# EAGLE design overall_connections (EAGLE 7.5.0)
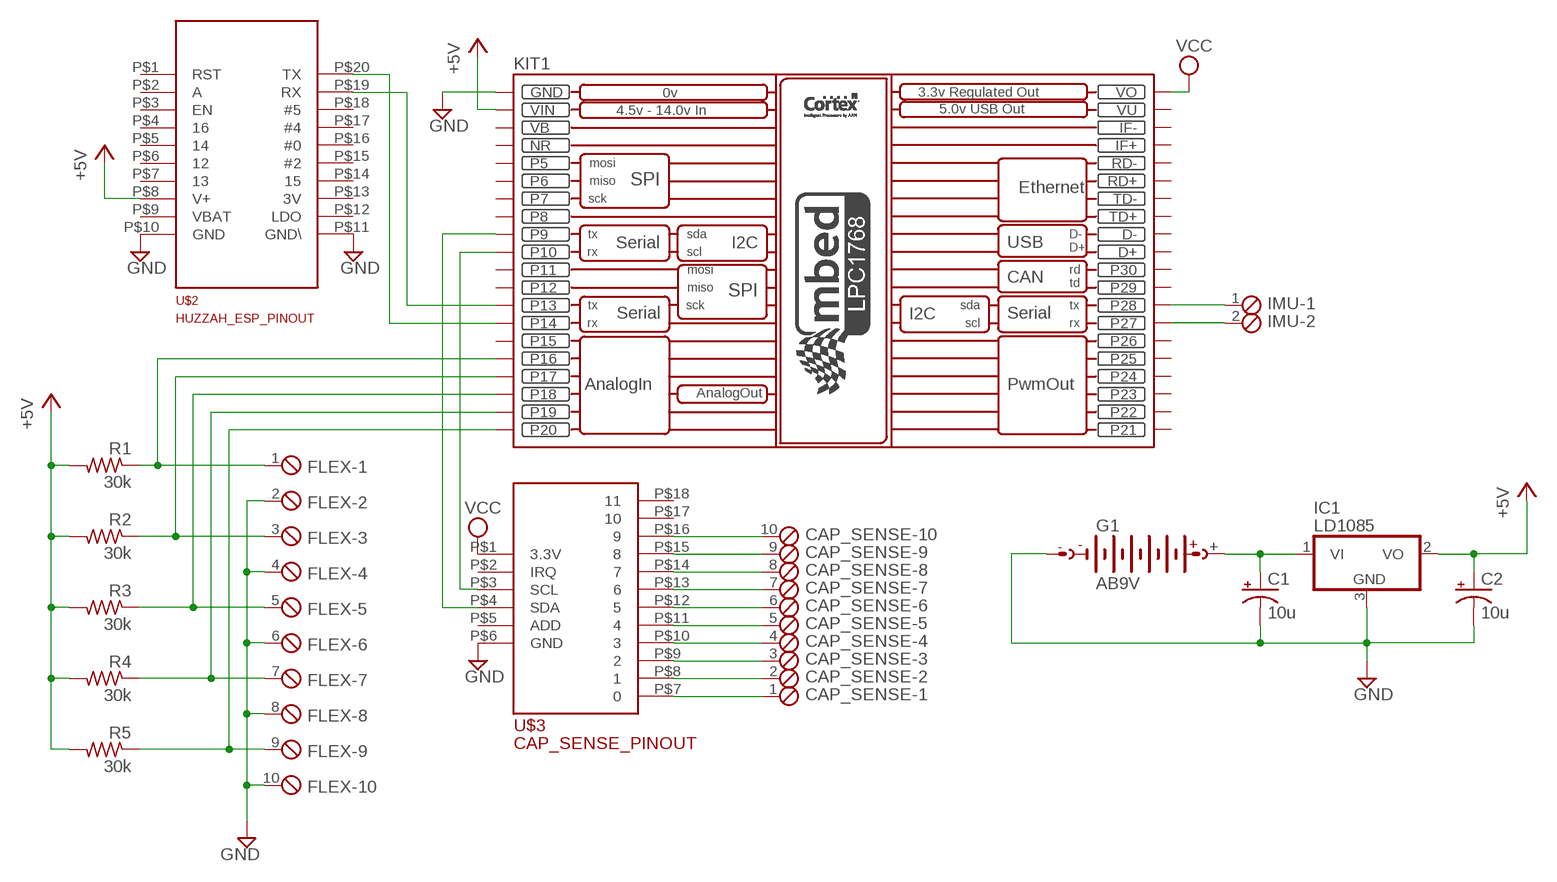
[diagram p0: schematic, sheet 1]

## Parts
C1  10u  CPOL-USE1.8-4  [E1,8-4]
C2  10u  CPOL-USE1.8-4  [E1,8-4]
CAP_SENSE  MPT10  [10POL254]
FLEX  MPT10  [10POL254]
G1  AB9V  [AB9V]
IC1  LD1085  7805T  [TO220H]
IMU  MPT2  [2POL254]
KIT1  MBED_NXP_LPC1768  [MBED-KIT]
R1  30k  R-US_0204/7  [0204/7]
R2  30k  R-US_0204/7  [0204/7]
R3  30k  R-US_0204/7  [0204/7]
R4  30k  R-US_0204/7  [0204/7]
R5  30k  R-US_0204/7  [0204/7]
U$2  HUZZAH_ESP_PINOUT  [DIP20]
U$3  CAP_SENSE_PINOUT  [DIP18]

## Nets
+5V: C2.+ IC1.2(VO) KIT1.VIN R1.2 R2.2 R3.2 R4.2 R5.2 U$2.P$8(V+)
FLEX1: FLEX.1 KIT1.P$16(P16) R1.1
FLEX2: FLEX.3 KIT1.P$17(P17) R2.1
FLEX3: FLEX.5 KIT1.P$18(P18) R3.1
FLEX4: FLEX.7 KIT1.P$19(P19) R4.1
FLEX5: FLEX.9 KIT1.P$20(P20) R5.1
GND: C1.- C2.- FLEX.2 FLEX.4 FLEX.6 FLEX.8 FLEX.10 G1.- IC1.3(GND) KIT1.GND U$2.P$10(GND) U$2.P$11(GND\) U$3.P$6(GND)
N$1: KIT1.P$14(P14) U$2.P$20(TX)
N$2: KIT1.P$13(P13) U$2.P$19(RX)
N$3: KIT1.P$9(P9) U$3.P$4(SDA)
N$4: KIT1.P$10(P10) U$3.P$3(SCL)
N$7: IMU.2 KIT1.P$27(P27)
N$8: IMU.1 KIT1.P$28(P28)
N$10: C1.+ G1.+ IC1.1(VI)
N$23: CAP_SENSE.1 U$3.P$7
N$24: CAP_SENSE.2 U$3.P$8
N$25: CAP_SENSE.3 U$3.P$9
N$26: CAP_SENSE.4 U$3.P$10
N$27: CAP_SENSE.5 U$3.P$11
N$28: CAP_SENSE.6 U$3.P$12
N$29: CAP_SENSE.7 U$3.P$13
N$30: CAP_SENSE.8 U$3.P$14
N$31: CAP_SENSE.9 U$3.P$15
N$32: CAP_SENSE.10 U$3.P$16
VCC: KIT1.VOUT(VO) U$3.P$1(3.3V)
Unconnected: KIT1.D+ KIT1.D- KIT1.IF+ KIT1.IF- KIT1.P$5(P5) KIT1.P$6(P6) KIT1.P$7(P7) KIT1.P$8(P8) KIT1.P$11(P11) KIT1.P$12(P12) KIT1.P$15(P15) KIT1.P$21(P21) KIT1.P$22(P22) KIT1.P$23(P23) KIT1.P$24(P24) KIT1.P$25(P25) KIT1.P$26(P26) KIT1.P$29(P29) KIT1.P$30(P30) KIT1.RD+ KIT1.RD- KIT1.TD+ KIT1.TD- U$2.P$1(RST) U$2.P$2(A) U$2.P$3(EN) U$2.P$4 U$2.P$5 U$2.P$6 U$2.P$7 U$2.P$9(VBAT) U$2.P$12(LDO) U$2.P$13(3V) U$2.P$14 U$2.P$15(#2) U$2.P$16(#0) U$2.P$17(#4) U$2.P$18(#5) U$3.P$2(IRQ) U$3.P$5(ADD) U$3.P$17 U$3.P$18

## Power pins joined to a net without a drawn wire
NR: KIT1.NR
VB: KIT1.VB
VU: KIT1.VU

## Library data of the parts
C1 C2 = rcl:CPOL-US: POLARIZED CAPACITOR, American symbol
CAP_SENSE FLEX = con-phoenix-254:MPT10: PHOENIX CONNECTOR; OC_FARNELL: unknown; OC_NEWARK: unknown
G1 = battery:AB9V: 9-V BATTERY CLIP
IC1 = smart_glove_breakout:78*: Positive VOLTAGE REGULATOR Source: http://cache.national.com/ds/LM/LM78L05.pdf http://www.fairchildsemi.com/ds/LM/LM7805.pdf
IMU = con-phoenix-254:MPT2: PHOENIX CONNECTOR; OC_FARNELL: unknown; OC_NEWARK: unknown
KIT1 = MBED_v2.1_avbotz:MBED_NXP_LPC1768: Mbed LPC1768 - ARM CORTEX v2.1 * Schematic symbol is now placed in eagles's default raster. *The pads diameter are suitable for routing between mbed pins * mbed pads are 0.8 mm drill diameter. --------------------------------------------- Created by: Mohamed Yousry *Alexandria, Egypt *Email: mohamed.yousry@ieeegoldegypt.org
R1-R5 = resistor:R-US_: RESISTOR, American symbol
U$2 = smart_glove_breakout:HUZZAH_ESP_PINOUT
U$3 = smart_glove_breakout:CAP_SENSE_PINOUT

## Board
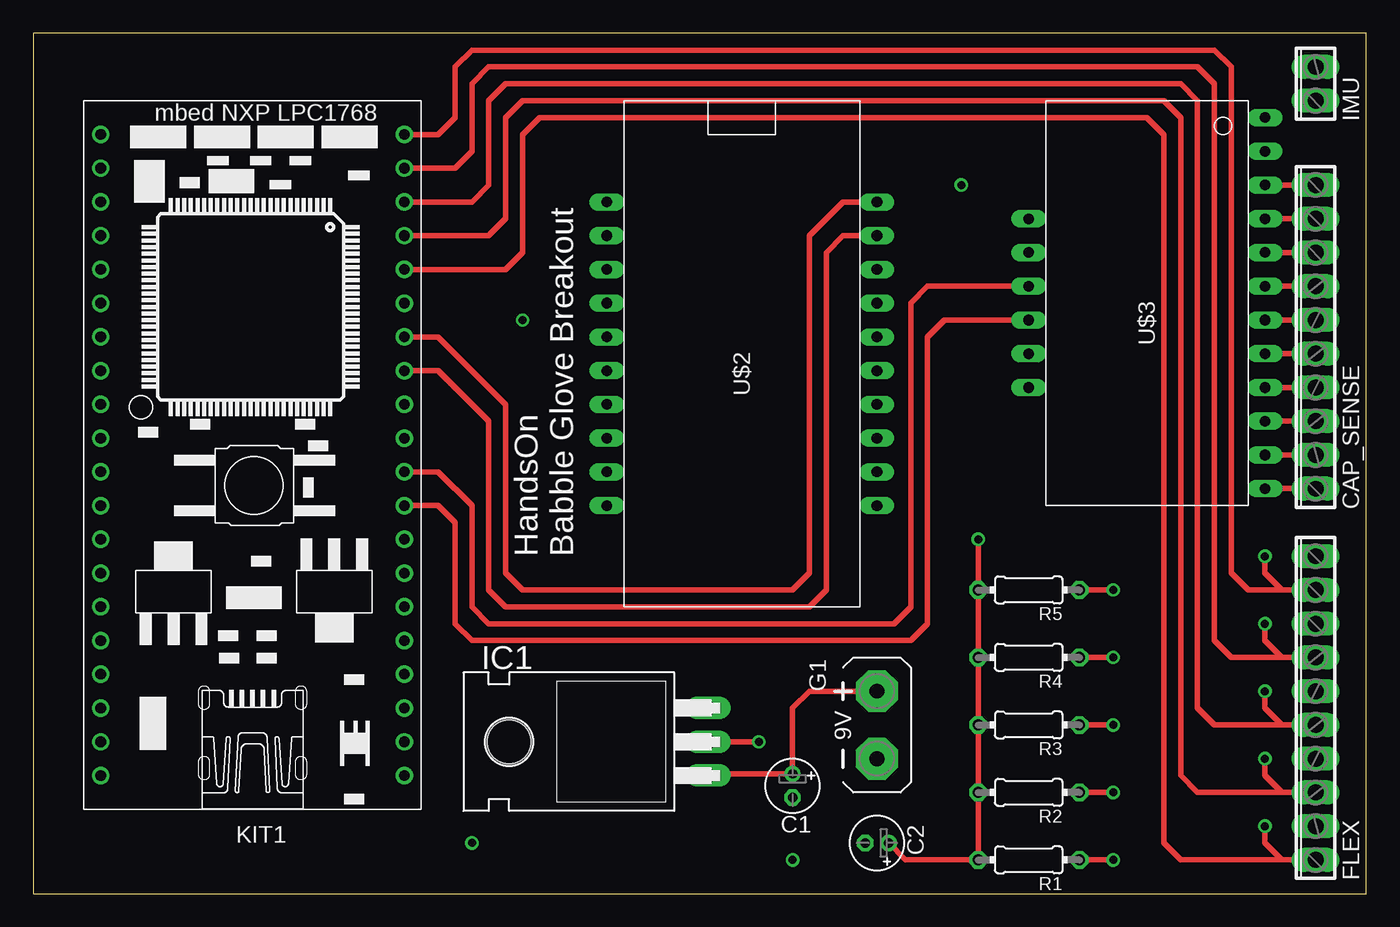
[diagram p1: board, top side]
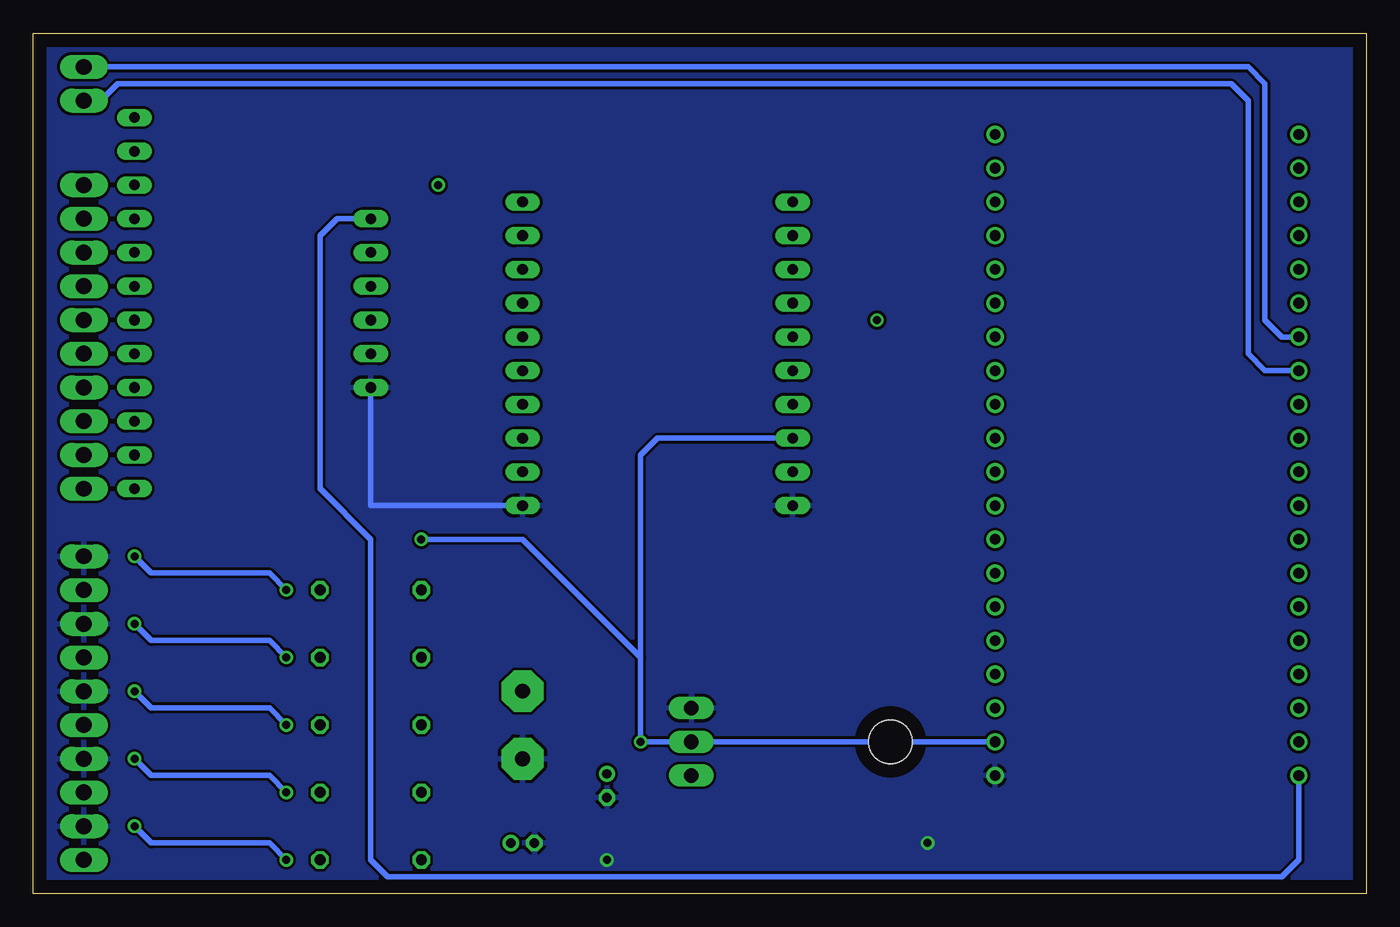
[diagram p2: board, bottom side, seen from below]

Size 100.33 x 64.77 mm. Coordinates in mm from the lower left corner, seen from the top.
Outline: 0,0 100.33,0 100.33,64.77 0,64.77 0,0
Copper layers (1*16): Top 0.035mm / dielectric 1.5mm / Bottom 0.035mm
Design rules "default": minimum track width 10mil, minimum drill 24mil, track to track 8mil, track to pad 8mil, pad to pad 8mil, via to via 8mil, smd to smd 8mil, copper to edge 40mil, drill to drill 8mil, minimum pad ring 10mil, minimum via ring 8mil, stop-mask expansion 4mil, vias tented up to drill 0mil, thermal gap 10mil

### Footprints (pad centres in the part's own frame; a part is rotated, then mirrored left to right if it is on the bottom)
E1,8-4 = drill 0.711 pad 1.168: + -0.889,0 | drill 0.711 pad 1.168 octagon: - 0.889,0
10POL254 = drill 1.2 long: 1 -11.43,0; 2 -8.89,0; 3 -6.35,0; 4 -3.81,0; 5 -1.27,0; 6 1.27,0; 7 3.81,0; 8 6.35,0; 9 8.89,0; 10 11.43,0
AB9V = drill 1.118 pad 3.15 octagon: + 0,2.54; - 0,-2.54
TO220H = drill 1.118 long: 1 -2.54,-10.16; 2 0,-10.16; 3 2.54,-10.16 | hole 3.302: 0,4.826
2POL254 = drill 1.2 long: 1 -1.27,0; 2 1.27,0
MBED-KIT = drill 0.8: D+ 11.43,1.27; D- 11.43,3.81; GND -11.43,24.13; IF+ 11.43,16.51; IF- 11.43,19.05; NR -11.43,16.51; P$5 -11.43,13.97; P$6 -11.43,11.43; P$7 -11.43,8.89; P$8 -11.43,6.35; P$9 -11.43,3.81; P$10 -11.43,1.27; P$11 -11.43,-1.27; P$12 -11.43,-3.81; P$13 -11.43,-6.35; P$14 -11.43,-8.89; P$15 -11.43,-11.43; P$16 -11.43,-13.97; P$17 -11.43,-16.51; P$18 -11.43,-19.05; P$19 -11.43,-21.59; P$20 -11.43,-24.13; P$21 11.43,-24.13; P$22 11.43,-21.59; P$23 11.43,-19.05; P$24 11.43,-16.51; P$25 11.43,-13.97; P$26 11.43,-11.43; P$27 11.43,-8.89; P$28 11.43,-6.35; P$29 11.43,-3.81; P$30 11.43,-1.27; RD+ 11.43,11.43; RD- 11.43,13.97; TD+ 11.43,6.35; TD- 11.43,8.89; VB -11.43,19.05; VIN -11.43,21.59; VOUT 11.43,24.13; VU 11.43,21.59
0204/7 = drill 0.813 octagon: 1 -3.81,0; 2 3.81,0
DIP20 = drill 0.8 long: P$1 0,-7.62; P$2 0,-10.16; P$3 0,-12.7; P$4 0,-15.24; P$5 0,-17.78; P$6 0,-20.32; P$7 0,-22.86; P$8 0,-25.4; P$9 0,-27.94; P$10 0,-30.48; P$11 20.32,-30.48; P$12 20.32,-27.94; P$13 20.32,-25.4; P$14 20.32,-22.86; P$15 20.32,-20.32; P$16 20.32,-17.78; P$17 20.32,-15.24; P$18 20.32,-12.7; P$19 20.32,-10.16; P$20 20.32,-7.62
DIP18 = drill 0.8 long: P$1 0,-7.62; P$2 0,-10.16; P$3 0,-12.7; P$4 0,-15.24; P$5 0,-17.78; P$6 0,-20.32; P$7 17.78,-27.94; P$8 17.78,-25.4; P$9 17.78,-22.86; P$10 17.78,-20.32; P$11 17.78,-17.78; P$12 17.78,-15.24; P$13 17.78,-12.7; P$14 17.78,-10.16; P$15 17.78,-7.62; P$16 17.78,-5.08; P$17 17.78,-2.54; P$18 17.78,0

### Placement (x,y rotation side)
C1  57.15,8.13 270 top
C2  63.5,3.81 180 top
CAP_SENSE  96.52,41.91 90 top
FLEX  96.52,13.97 90 top
G1  63.5,12.7 0 top
IC1  40.64,11.43 90 top
IMU  96.52,60.96 90 top
KIT1  16.51,33.02 180 top
R1  74.93,2.54 180 top
R2  74.93,7.62 180 top
R3  74.93,12.7 180 top
R4  74.93,17.78 180 top
R5  74.93,22.86 180 top
U$2  43.18,59.69 0 top
U$3  74.93,58.42 0 top

### Tracks (layer width: path | path; a pad name or v marks a point on that pad's centre or on a via)
+5V  (via drill 0.6)
  Top 0.406: v71.12,26.67 R5.2 R4.2 R3.2 R2.2 R1.2 65.66,2.54 C2.+ | IC1.2 v54.61,11.43
  Bottom 0.406: 54.61,17.78 v54.61,11.43 KIT1.VIN | 54.61,17.78 63.5,26.67 v71.12,26.67 | 54.61,17.78 54.61,33.02 53.34,34.29 U$2.P$8
FLEX1  (via drill 0.6)
  Top 0.406: KIT1.P$16 35.56,46.99 36.83,48.26 36.83,57.15 38.1,58.42 83.82,58.42 85.09,57.15 85.09,3.81 86.36,2.54 93.98,2.54 | 93.98,2.54 FLEX.1 | R1.1 v81.28,2.54 | 93.98,2.54 92.71,3.81 v92.71,5.08
  Bottom 0.406: v81.28,2.54 82.55,3.81 91.44,3.81 v92.71,5.08
FLEX2  (via drill 0.6)
  Top 0.406: KIT1.P$17 34.29,49.53 35.56,50.8 35.56,58.42 36.83,59.69 85.09,59.69 86.36,58.42 86.36,8.89 87.63,7.62 93.98,7.62 | 93.98,7.62 FLEX.3 | R2.1 v81.28,7.62 | 93.98,7.62 92.71,8.89 v92.71,10.16
  Bottom 0.406: v81.28,7.62 82.55,8.89 91.44,8.89 v92.71,10.16
FLEX3  (via drill 0.6)
  Top 0.406: KIT1.P$18 33.02,52.07 34.29,53.34 34.29,59.69 35.56,60.96 86.36,60.96 87.63,59.69 87.63,13.97 88.9,12.7 93.98,12.7 | 93.98,12.7 FLEX.5 | R3.1 v81.28,12.7 | v92.71,15.24 92.71,13.97 93.98,12.7
  Bottom 0.406: v81.28,12.7 82.55,13.97 91.44,13.97 v92.71,15.24
FLEX4  (via drill 0.6)
  Top 0.406: KIT1.P$19 31.75,54.61 33.02,55.88 33.02,60.96 34.29,62.23 87.63,62.23 88.9,60.96 88.9,19.05 90.17,17.78 93.98,17.78 | 93.98,17.78 FLEX.7 | 93.98,17.78 92.71,19.05 v92.71,20.32 | R4.1 v81.28,17.78
  Bottom 0.406: v81.28,17.78 82.55,19.05 91.44,19.05 v92.71,20.32
FLEX5  (via drill 0.6)
  Top 0.406: KIT1.P$20 30.48,57.15 31.75,58.42 31.75,62.23 33.02,63.5 88.9,63.5 90.17,62.23 90.17,24.13 91.44,22.86 93.98,22.86 | 93.98,22.86 FLEX.9 | R5.1 v81.28,22.86 | 93.98,22.86 92.71,24.13 v92.71,25.4
  Bottom 0.406: v81.28,22.86 82.55,24.13 91.44,24.13 v92.71,25.4
GND  (via drill 0.6)
  Bottom 0.406: U$3.P$6 74.93,29.21 U$2.P$11
  other vias: 33.02,3.81 57.15,2.54
  pour Bottom: -2.54,67.31 102.87,67.31 102.87,64.77 102.87,-2.54 -2.54,-2.54
N$1
  Top 0.406: U$2.P$20 60.96,52.07 58.42,49.53 58.42,24.13 57.15,22.86 36.83,22.86 35.56,24.13 35.56,36.83 30.48,41.91 KIT1.P$14
N$2
  Top 0.406: U$2.P$19 60.96,49.53 59.69,48.26 59.69,22.86 58.42,21.59 35.56,21.59 34.29,22.86 34.29,35.56 30.48,39.37 KIT1.P$13
N$3
  Top 0.406: KIT1.P$9 30.48,29.21 31.75,27.94 31.75,20.32 33.02,19.05 66.04,19.05 67.31,20.32 67.31,41.91 68.58,43.18 U$3.P$4
N$4
  Top 0.406: KIT1.P$10 30.48,31.75 33.02,29.21 33.02,21.59 34.29,20.32 64.77,20.32 66.04,21.59 66.04,44.45 67.31,45.72 U$3.P$3
N$5  (via drill 0.6)
  other vias: 36.83,43.18
N$6  (via drill 0.6)
  other vias: 69.85,53.34
N$7
  Bottom 0.406: IMU.2 8.89,62.23 7.62,60.96 7.62,43.18 6.35,41.91 KIT1.P$27
N$8
  Bottom 0.406: IMU.1 95.25,59.69 93.98,60.96 10.16,60.96 8.89,59.69 8.89,40.64 7.62,39.37 KIT1.P$28
N$10
  Top 0.406: G1.+ 58.42,15.24 57.15,13.97 C1.+ 50.93,9.02 IC1.1
N$23
  Top 0.406: U$3.P$7 CAP_SENSE.1
N$24
  Top 0.406: U$3.P$8 CAP_SENSE.2
N$25
  Top 0.406: U$3.P$9 CAP_SENSE.3
N$26
  Top 0.406: U$3.P$10 CAP_SENSE.4
N$27
  Top 0.406: U$3.P$11 CAP_SENSE.5
N$28
  Top 0.406: U$3.P$12 CAP_SENSE.6
N$29
  Top 0.406: U$3.P$13 CAP_SENSE.7
N$30
  Top 0.406: U$3.P$14 CAP_SENSE.8
N$31
  Top 0.406: U$3.P$15 CAP_SENSE.9
N$32
  Top 0.406: U$3.P$16 CAP_SENSE.10
VCC
  Bottom 0.406: KIT1.VOUT 5.08,2.54 6.35,1.27 73.66,1.27 74.93,2.54 74.93,26.67 78.74,30.48 78.74,49.53 77.47,50.8 U$3.P$1

### Text on the board
tNames: HandsOn / Babble Glove Breakout